# Altium schematic sheet interface.SchDoc
size A4
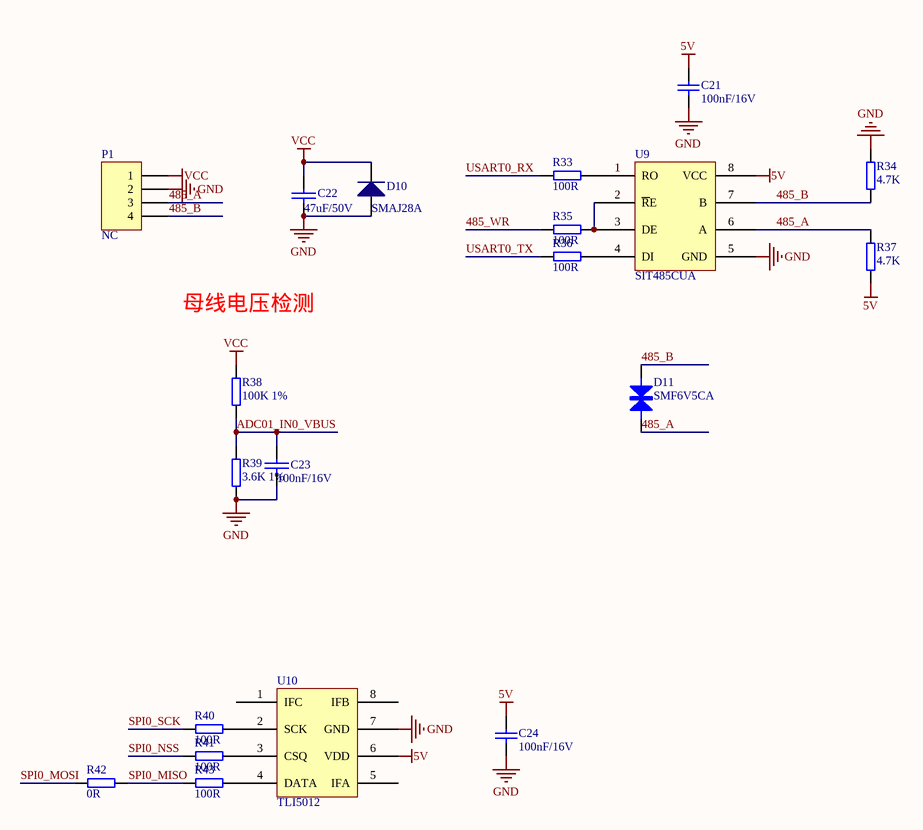
[diagram p0: interface.SchDoc]

## Parts
C21  100nF/16V  [C0402]
C22  47uF/50V  [C1210_N]
C23  100nF/16V  [C0402]
C24  100nF/16V  [C0402]
D10  SMAJ28A  [DO-214AC SMA]
D11  SMF6V5CA  [SOD-123]
P1  NC  [2.54-4]
R33  100R  [R0402]
R34  4.7K  [R0402]
R35  100R  [R0402]
R36  100R  [R0402]
R37  4.7K  [R0402]
R38  100K 1%  [R0402]
R39  3.6K 1%  [R0402]
R40  100R  [R0402]
R41  100R  [R0402]
R42  0R  [R0402]
R43  100R  [R0402]
U9  SIT485CUA  [VSSOP/MSOP-8]
U10  TLI5012  [SOIC-8]

## Nets
5V: C21.1 C24.1 R37.1 U9.8(VCC) U10.6(VDD)
GND: C21.2 C22.2 C23.2 C24.2 D10.1 P1.2 R34.2 R39.1 U9.5(GND) U10.7(GND)
VCC: C22.1 D10.2 P1.1 R38.2
485_A: D11.2(Anode) P1.3 R37.2 U9.6(A)
485_B: D11.1(Anode) P1.4 R34.1 U9.7(B)
485_WR: R35.2
ADC01_IN0_VBUS: C23.1 R38.1 R39.2
SPI0_MISO: R42.1 R43.2
SPI0_MOSI: R42.2
SPI0_NSS: R41.2
SPI0_SCK: R40.2
USART0_RX: R33.2
USART0_TX: R36.2
NetR33_1: R33.1 U9.1(RO)
NetR35_1: R35.1 U9.2(~{R}E) U9.3(DE)
NetR36_1: R36.1 U9.4(DI)
NetR40_1: R40.1 U10.2(SCK)
NetR41_1: R41.1 U10.3(CSQ)
NetR43_1: R43.1 U10.4(DATA)

Not connected (* = marked no-connect by the designer): U10 1(IFC) 5(IFA) 8(IFB)

## Notes on the sheet
- 母线电压检测

## Library data of the parts
C21 C24 = cap
C22 C23 = CAP: Capacitor
D10 = Diode
D11 = Bi-DIODES
P1 = Header 4: LatestRevisionDate: 17-Jul-2002; LatestRevisionNote: Re-released for DXP Platform.; Publisher: Altium Limited
R33-R43 = Resistance
U9 = SP485
U10 = TLE5012